# EAGLE design REG_1_0 (EAGLE 8.3.2)
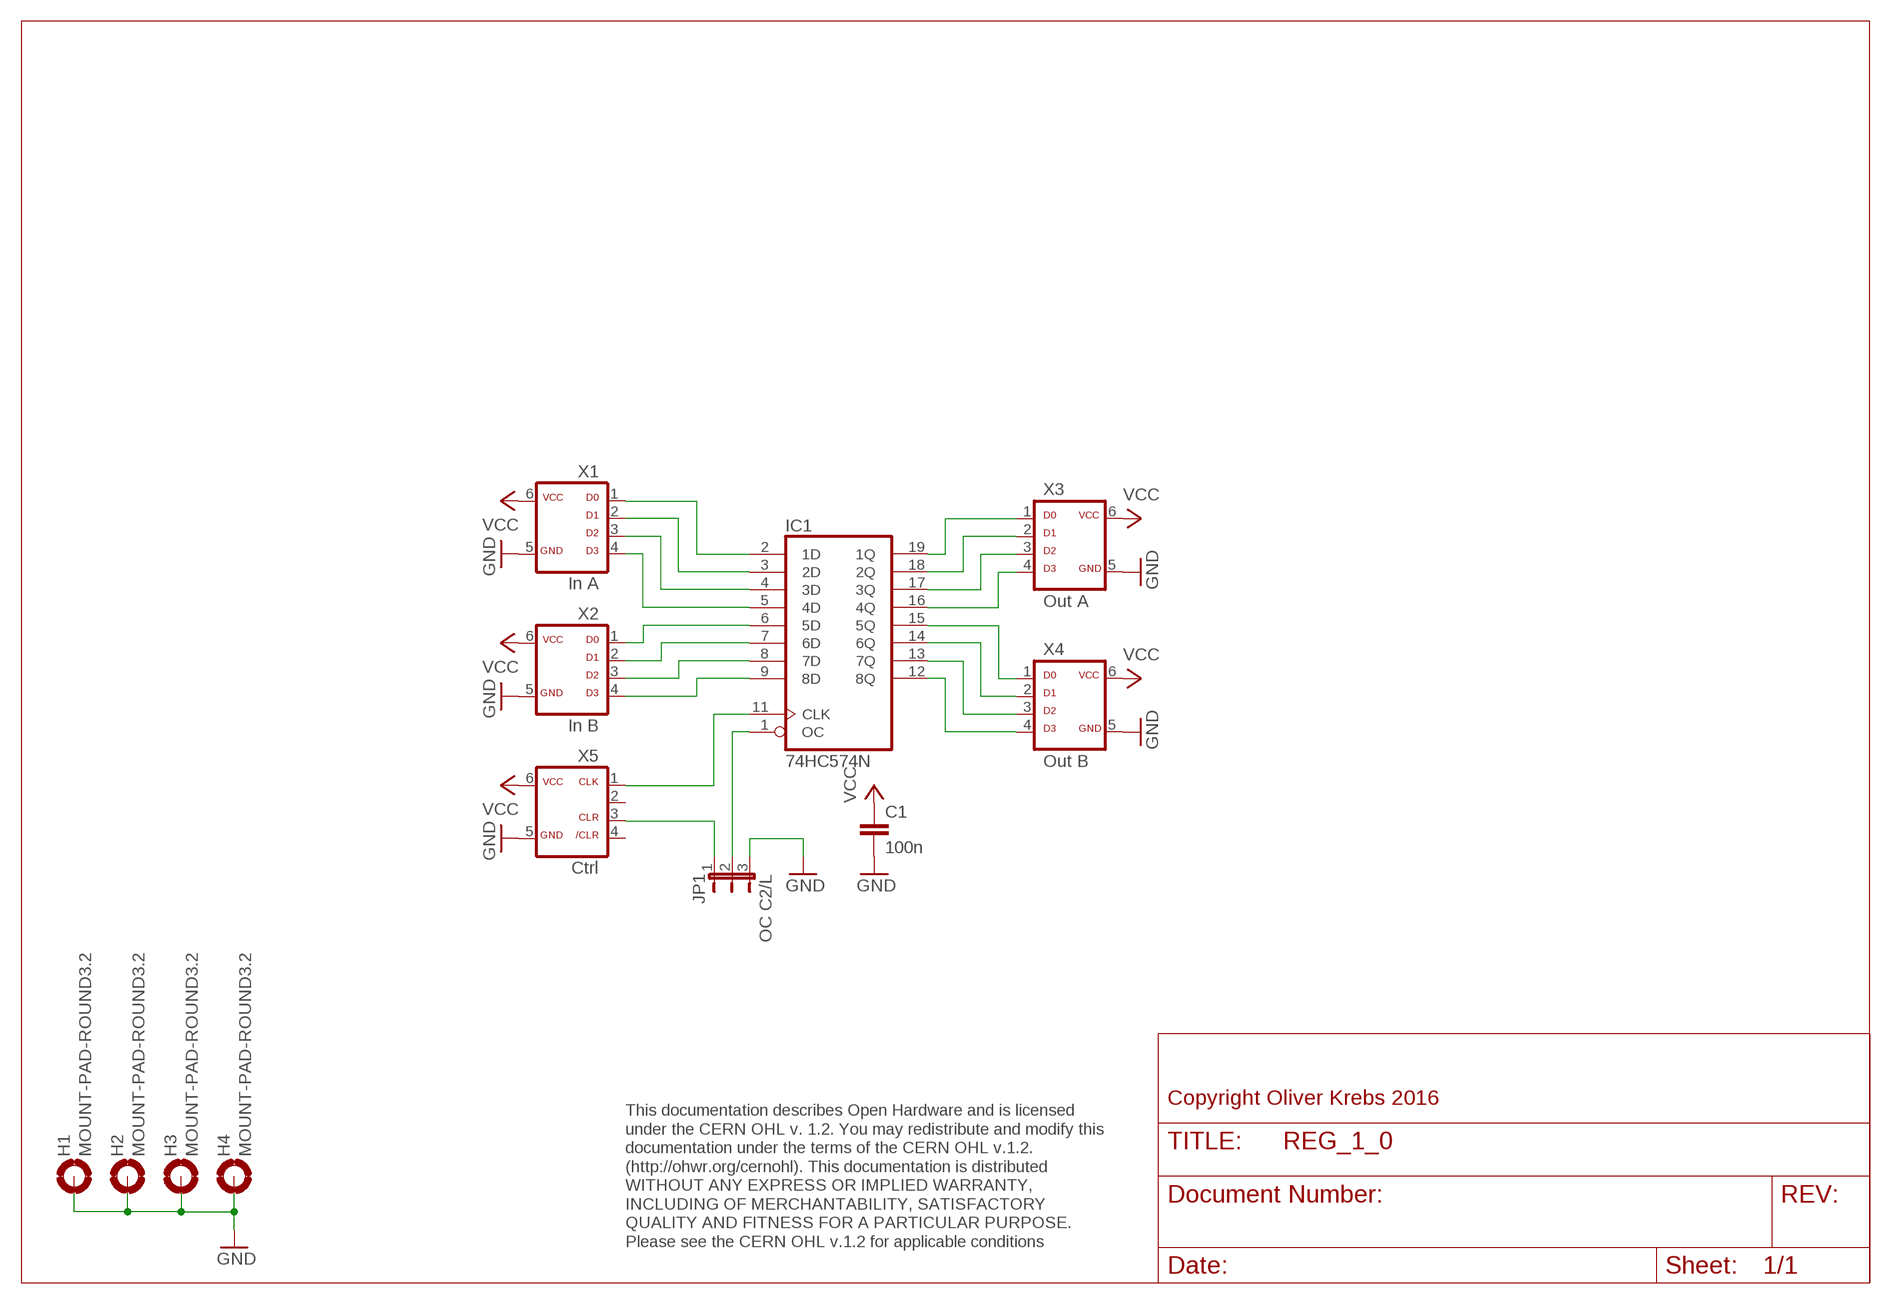
[diagram p0: schematic, sheet 1]

## Parts
C1  100n  C-EU050-025X075  [C050-025X075]
H1  MOUNT-PAD-ROUND3.2  [3,2-PAD]
H2  MOUNT-PAD-ROUND3.2  [3,2-PAD]
H3  MOUNT-PAD-ROUND3.2  [3,2-PAD]
H4  MOUNT-PAD-ROUND3.2  [3,2-PAD]
IC1  74HC574N  [DIL20]
JP1  OC C2/L  JP2E  [JP2]
X1  In A  ML6D  [ML-6]
X2  In B  ML6D  [ML-6]
X3  Out A  ML6D  [ML-6]
X4  Out B  ML6D  [ML-6]
X5  Ctrl  ML6C  [ML-6]

## Nets
GND: C1.2 H1.B3,2(MOUNT) H2.B3,2(MOUNT) H3.B3,2(MOUNT) H4.B3,2(MOUNT) JP1.3 X1.5 X2.5 X3.5 X4.5 X5.5
N$1: IC1.2(1D) X1.1
N$2: IC1.3(2D) X1.2
N$3: IC1.4(3D) X1.3
N$4: IC1.5(4D) X1.4
N$5: IC1.6(5D) X2.1
N$6: IC1.7(6D) X2.2
N$7: IC1.8(7D) X2.3
N$8: IC1.9(8D) X2.4
N$9: IC1.11(CLK) X5.1
N$10: IC1.1(OC) JP1.2
N$11: IC1.19(1Q) X3.1
N$12: IC1.18(2Q) X3.2
N$13: IC1.17(3Q) X3.3
N$14: IC1.16(4Q) X3.4
N$15: IC1.15(5Q) X4.1
N$16: IC1.14(6Q) X4.2
N$17: IC1.13(7Q) X4.3
N$18: IC1.12(8Q) X4.4
N$19: JP1.1 X5.3
VCC: C1.1 X1.6 X2.6 X3.6 X4.6 X5.6
Unconnected: X5.2 X5.4

## Notes on the sheet
- Copyright Oliver Krebs 2016
- This documentation describes Open Hardware and is licensed 
  under the CERN OHL v. 1.2. You may redistribute and modify this 
  documentation under the terms of the CERN OHL v.1.2. 
  (http://ohwr.org/cernohl). This documentation is distributed
  WITHOUT ANY EXPRESS OR IMPLIED WARRANTY, 
  INCLUDING OF MERCHANTABILITY, SATISFACTORY 
  QUALITY AND FITNESS FOR A PARTICULAR PURPOSE. 
  Please see the CERN OHL v.1.2 for applicable conditions

## Power pins joined to a net without a drawn wire
GND: IC1.10(GND)
VCC: IC1.20(VCC)

## Library data of the parts
C1 = 01-my_rcl:C-EU: CAPACITOR, European symbol
H1-H4 = holes:MOUNT-PAD-ROUND: MOUNTING PAD, round
IC1 = 74xx-eu:74*574: 8-bit D type FLIP FLOP bus driver
JP1 = jumper:JP2E: JUMPER
X1-X4 = 01-my-con:ML6D
X5 = 01-my-con:ML6C

## Board
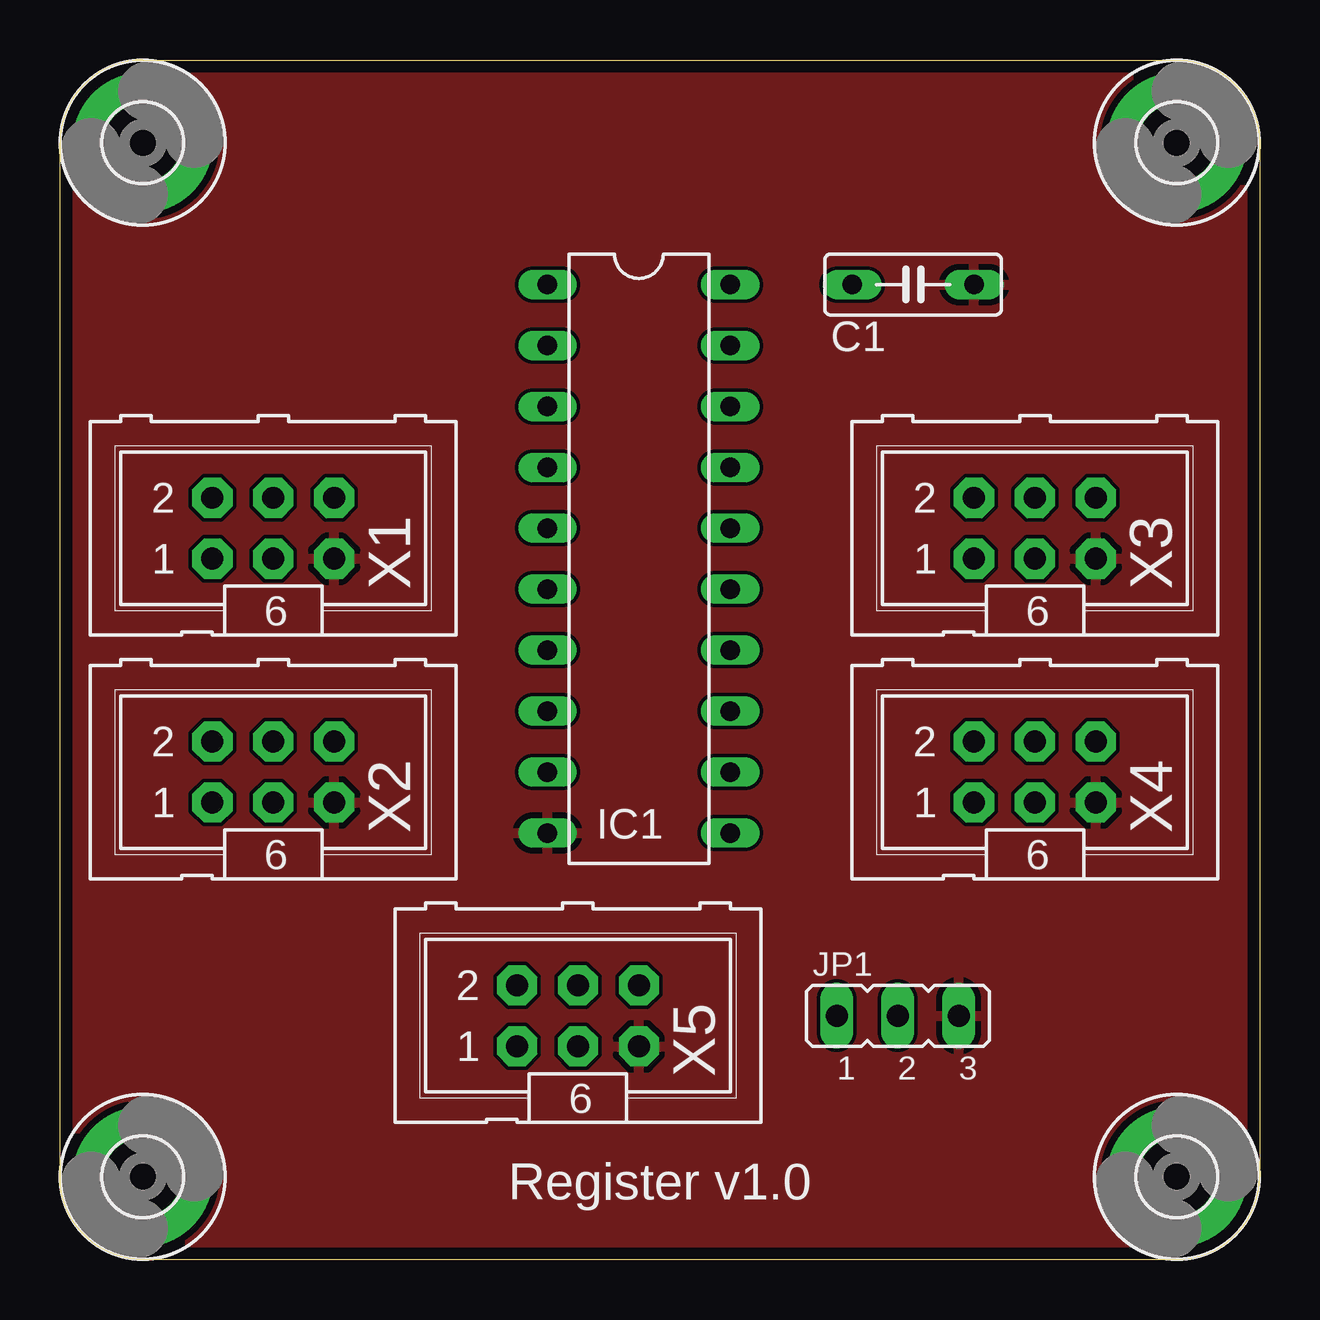
[diagram p1: board, top side]
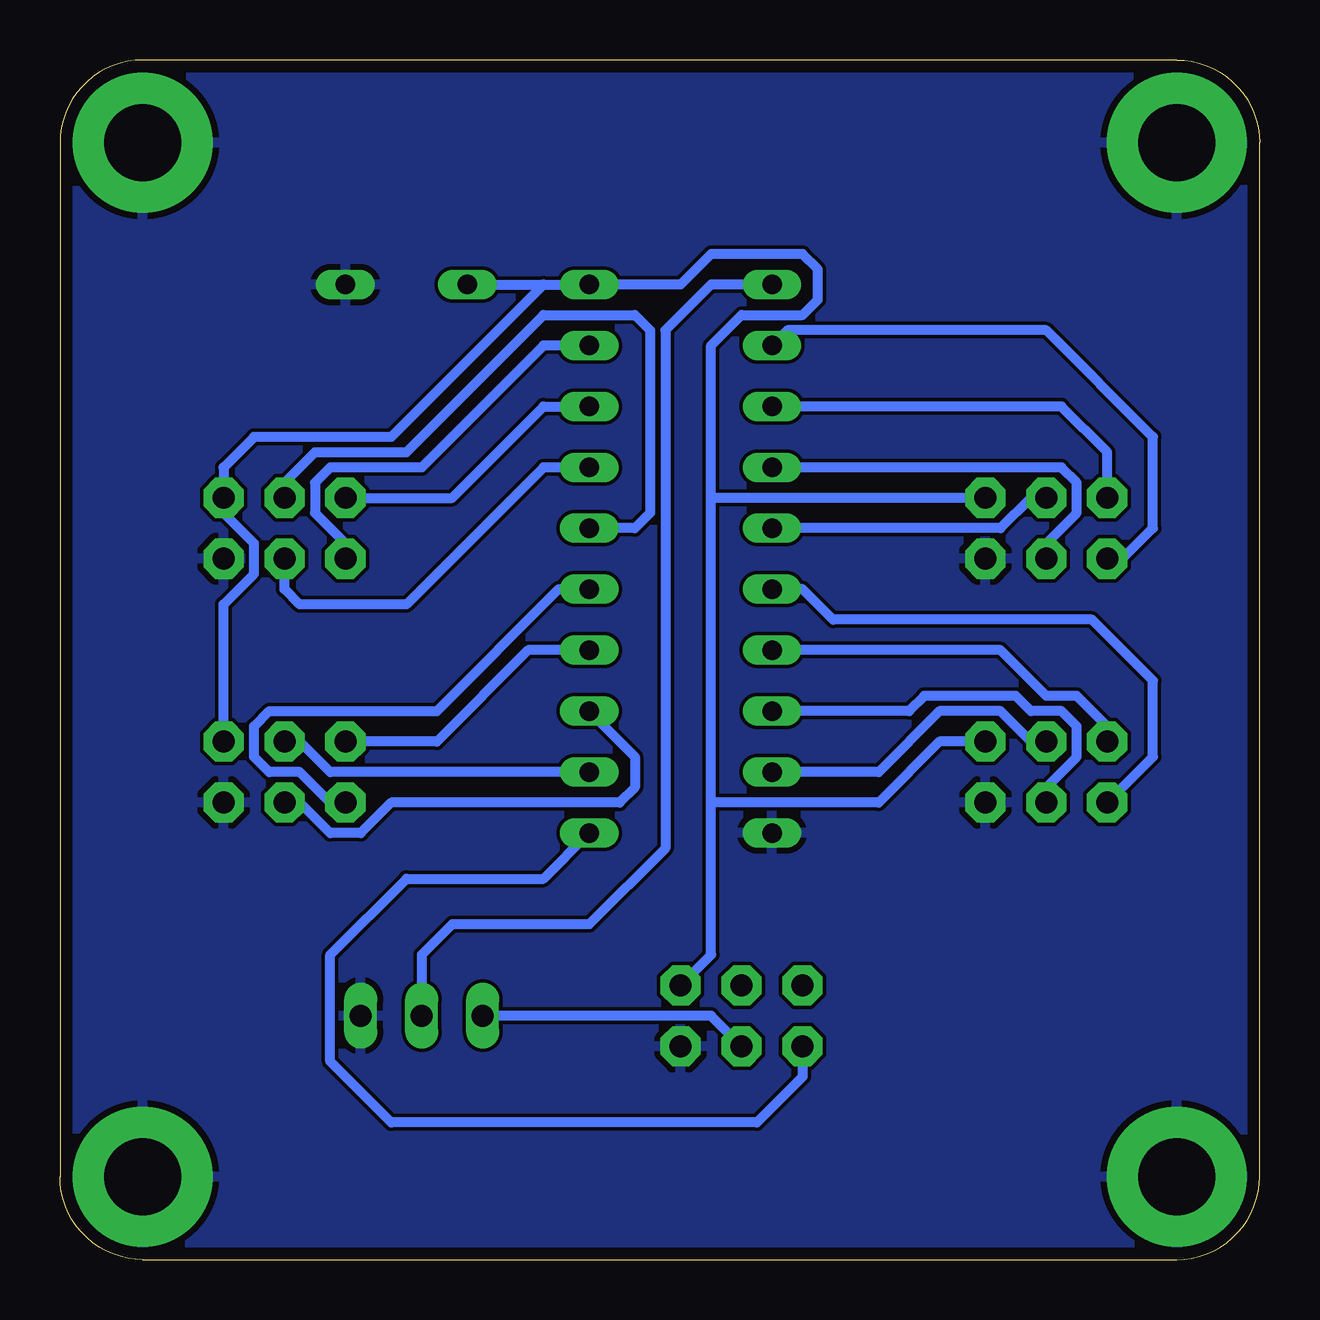
[diagram p2: board, bottom side, seen from below]

Size 50 x 50 mm. Coordinates in mm from the lower left corner, seen from the top.
Outline: 0,3.45 0,46.55 arc-90 3.45,50 46.55,50 arc-90 50,46.55 50,3.45 arc-90 46.55,0 3.45,0 arc-90 0,3.45
Copper layers (1*16): Top 0.035mm / dielectric 1.6mm / Bottom 0.035mm
Design rules "Elecrow_2-layer_PCB_eagle_rule": minimum track width 6mil, minimum drill 12mil, track to track 6mil, track to pad 6mil, pad to pad 6mil, via to via 8mil, smd to smd 0mil, copper to edge 20mil, drill to drill 10mil, minimum pad ring 6mil, minimum via ring 6mil, stop-mask expansion 0mil, vias tented up to drill 100mil, thermal gap 10mil

### Footprints (pad centres in the part's own frame; a part is rotated, then mirrored left to right if it is on the bottom)
C050-025X075 = drill 0.813 long: 1 -2.54,0; 2 2.54,0
3,2-PAD = drill 3.2 pad 5.842: B3,2 0,0
DIL20 = drill 0.813 long: 1 -11.43,-3.81; 2 -8.89,-3.81; 3 -6.35,-3.81; 4 -3.81,-3.81; 5 -1.27,-3.81; 6 1.27,-3.81; 7 3.81,-3.81; 8 6.35,-3.81; 9 8.89,-3.81; 10 11.43,-3.81; 11 11.43,3.81; 12 8.89,3.81; 13 6.35,3.81; 14 3.81,3.81; 15 1.27,3.81; 16 -1.27,3.81; 17 -3.81,3.81; 18 -6.35,3.81; 19 -8.89,3.81; 20 -11.43,3.81
JP2 = drill 0.914 long: 1 -2.54,0; 2 0,0; 3 2.54,0
ML-6 = drill 0.914 pad 1.676 octagon: 1 -2.54,-1.27; 2 -2.54,1.27; 3 0,-1.27; 4 0,1.27; 5 2.54,-1.27; 6 2.54,1.27

### Placement (x,y rotation side)
C1  35.56,40.64 0 top
H1  3.45,3.45 0 top
H2  3.45,46.55 0 top
H3  46.55,46.55 0 top
H4  46.55,3.45 0 top
IC1  24.13,29.21 270 top
JP1  34.92,10.16 0 top
X1  8.89,30.48 0 top
X2  8.89,20.32 0 top
X3  40.64,30.48 0 top
X4  40.64,20.32 0 top
X5  21.59,10.16 0 top

### Tracks (layer width: path | path; a pad name or v marks a point on that pad's centre or on a via)
GND
  pour Bottom: 0,0 50.8,0 50.8,50.8 0,50.8
  pour Top: 0,50.16 50.16,50.16 50.16,0 0,0
N$1
  Bottom 0.406: X1.1 5.71,29.21 4.45,30.48 4.45,34.29 8.89,38.73 19.68,38.73 IC1.2
N$2
  Bottom 0.406: X1.2 6.35,33.66 8.26,35.56 IC1.3
N$3
  Bottom 0.406: X1.3 8.89,29.84 7.62,31.11 7.62,32.38 8.26,33.02 IC1.4
N$4
  Bottom 0.406: X1.4 9.53,31.75 10.79,30.48 IC1.5
N$5
  Bottom 0.406: X2.1 4.45,20.95 4.45,24.13 6.99,26.67 17.78,26.67 19.05,27.94 IC1.6
N$6
  Bottom 0.406: X2.2 6.35,22.23 7.62,23.5 8.89,23.5 10.79,25.4 IC1.7
N$7
  Bottom 0.406: X2.3 8.89,19.68 7.62,20.95 7.62,22.23 8.26,22.86 9.53,22.86 10.16,23.5 13.97,23.5 14.61,22.86 IC1.8
N$8
  Bottom 0.406: X2.4 9.53,21.59 10.79,22.86 13.34,22.86 15.88,20.32 IC1.9
N$9
  Bottom 0.406: X5.1 19.05,7.62 20.95,5.71 36.2,5.71 38.73,8.26 38.73,12.7 35.56,15.88 29.84,15.88 IC1.11
N$10
  Bottom 0.406: IC1.1 22.86,40.64 24.77,38.73 24.77,17.14 27.94,13.97 33.66,13.97 34.92,12.7 JP1.2
N$11
  Bottom 0.406: IC1.19 29.84,38.1 34.92,33.02 38.73,33.02 39.37,32.38 39.37,31.11 38.1,29.84 X3.1
N$12
  Bottom 0.406: X3.2 33.66,31.75 29.84,35.56 IC1.18
N$13
  Bottom 0.406: IC1.17 29.84,33.02 35.56,27.3 40.01,27.3 40.64,27.94 X3.3
N$14
  Bottom 0.406: X3.4 40.64,32.38 39.37,33.66 35.56,33.66 29.84,39.37 26.04,39.37 25.4,38.73 25.4,31.11 26.04,30.48 IC1.16
N$15
  Bottom 0.406: X4.1 38.73,19.05 40.01,20.32 41.27,20.32 41.91,20.95 41.91,22.23 41.27,22.86 34.29,22.86 29.21,27.94 IC1.15
N$16
  Bottom 0.406: IC1.14 30.48,25.4 34.29,21.59 X4.2
N$17
  Bottom 0.406: IC1.13 26.04,20.95 26.04,19.68 26.67,19.05 36.2,19.05 37.47,17.78 38.73,17.78 40.01,19.05 X4.3
N$18
  Bottom 0.406: IC1.12 38.73,20.32 40.01,21.59 X4.4
N$19
  Bottom 0.406: X5.3 22.86,10.16 JP1.1
VCC
  Bottom 0.406: X4.6 43.18,27.3 41.91,28.57 41.91,29.84 43.18,31.11 X3.6 43.18,33.02 41.91,34.29 36.2,34.29 29.84,40.64 | C1.1 29.84,40.64 | 29.84,40.64 IC1.20 24.13,40.64 22.86,41.91 19.05,41.91 18.41,41.27 18.41,40.01 19.05,39.37 21.59,39.37 22.86,38.1 22.86,31.75 | X1.6 22.86,31.75 | X2.6 13.34,21.59 15.88,19.05 22.86,19.05 | 22.86,19.05 22.86,31.75 | X5.6 22.86,12.7 22.86,19.05

### Text on the board
tNames: Register v1.0
200bmp: E:/Bilder/Elektronik/Modulion/Mexdulon/mexdulon_50x50_pcb.bmp